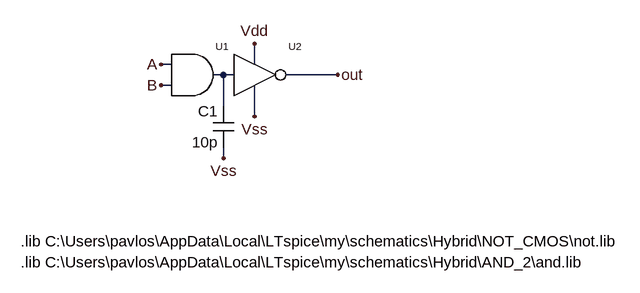
[diagram p0: schematic nand.asc]
nand.asc, the LTspice schematic file:
Version 4
SHEET 1 880 680
WIRE -432 -144 -448 -144
WIRE -304 -144 -304 -176
WIRE -352 -128 -368 -128
WIRE -336 -128 -352 -128
WIRE -176 -128 -256 -128
WIRE -432 -112 -448 -112
WIRE -352 -80 -352 -128
WIRE -304 -64 -304 -112
WIRE -352 0 -352 -16
FLAG -176 -128 out
FLAG -304 -64 Vss
FLAG -304 -176 Vdd
FLAG -448 -144 A
FLAG -448 -112 B
FLAG -352 0 Vss
SYMBOL and -432 -96 R0
SYMATTR InstName U1
SYMBOL not -336 -96 R0
SYMATTR InstName U2
SYMBOL cap -336 -80 M0
SYMATTR InstName C1
SYMATTR Value 10p
TEXT -664 128 Left 2 !.lib C:\\Users\\pavlos\\AppData\\Local\\LTspice\\my\\schematics\\Hybrid\\NOT_CMOS\\not.lib
TEXT -664 160 Left 2 !.lib C:\\Users\\pavlos\\AppData\\Local\\LTspice\\my\\schematics\\Hybrid\\AND_2\\and.lib

The netlist it stands for:
* nand.asc
XU1 A B N001 and  ; pins A B Y
XU2 N001 out Vdd Vss not  ; pins A Y Vdd Vss
C1 N001 Vss 10p
.lib C:\Users\pavlos\AppData\Local\LTspice\my\schematics\Hybrid\NOT_CMOS\not.lib
.lib C:\Users\pavlos\AppData\Local\LTspice\my\schematics\Hybrid\AND_2\and.lib
.backanno
.end